# EAGLE design PVDF_pre_amp (EAGLE 7.5.0)
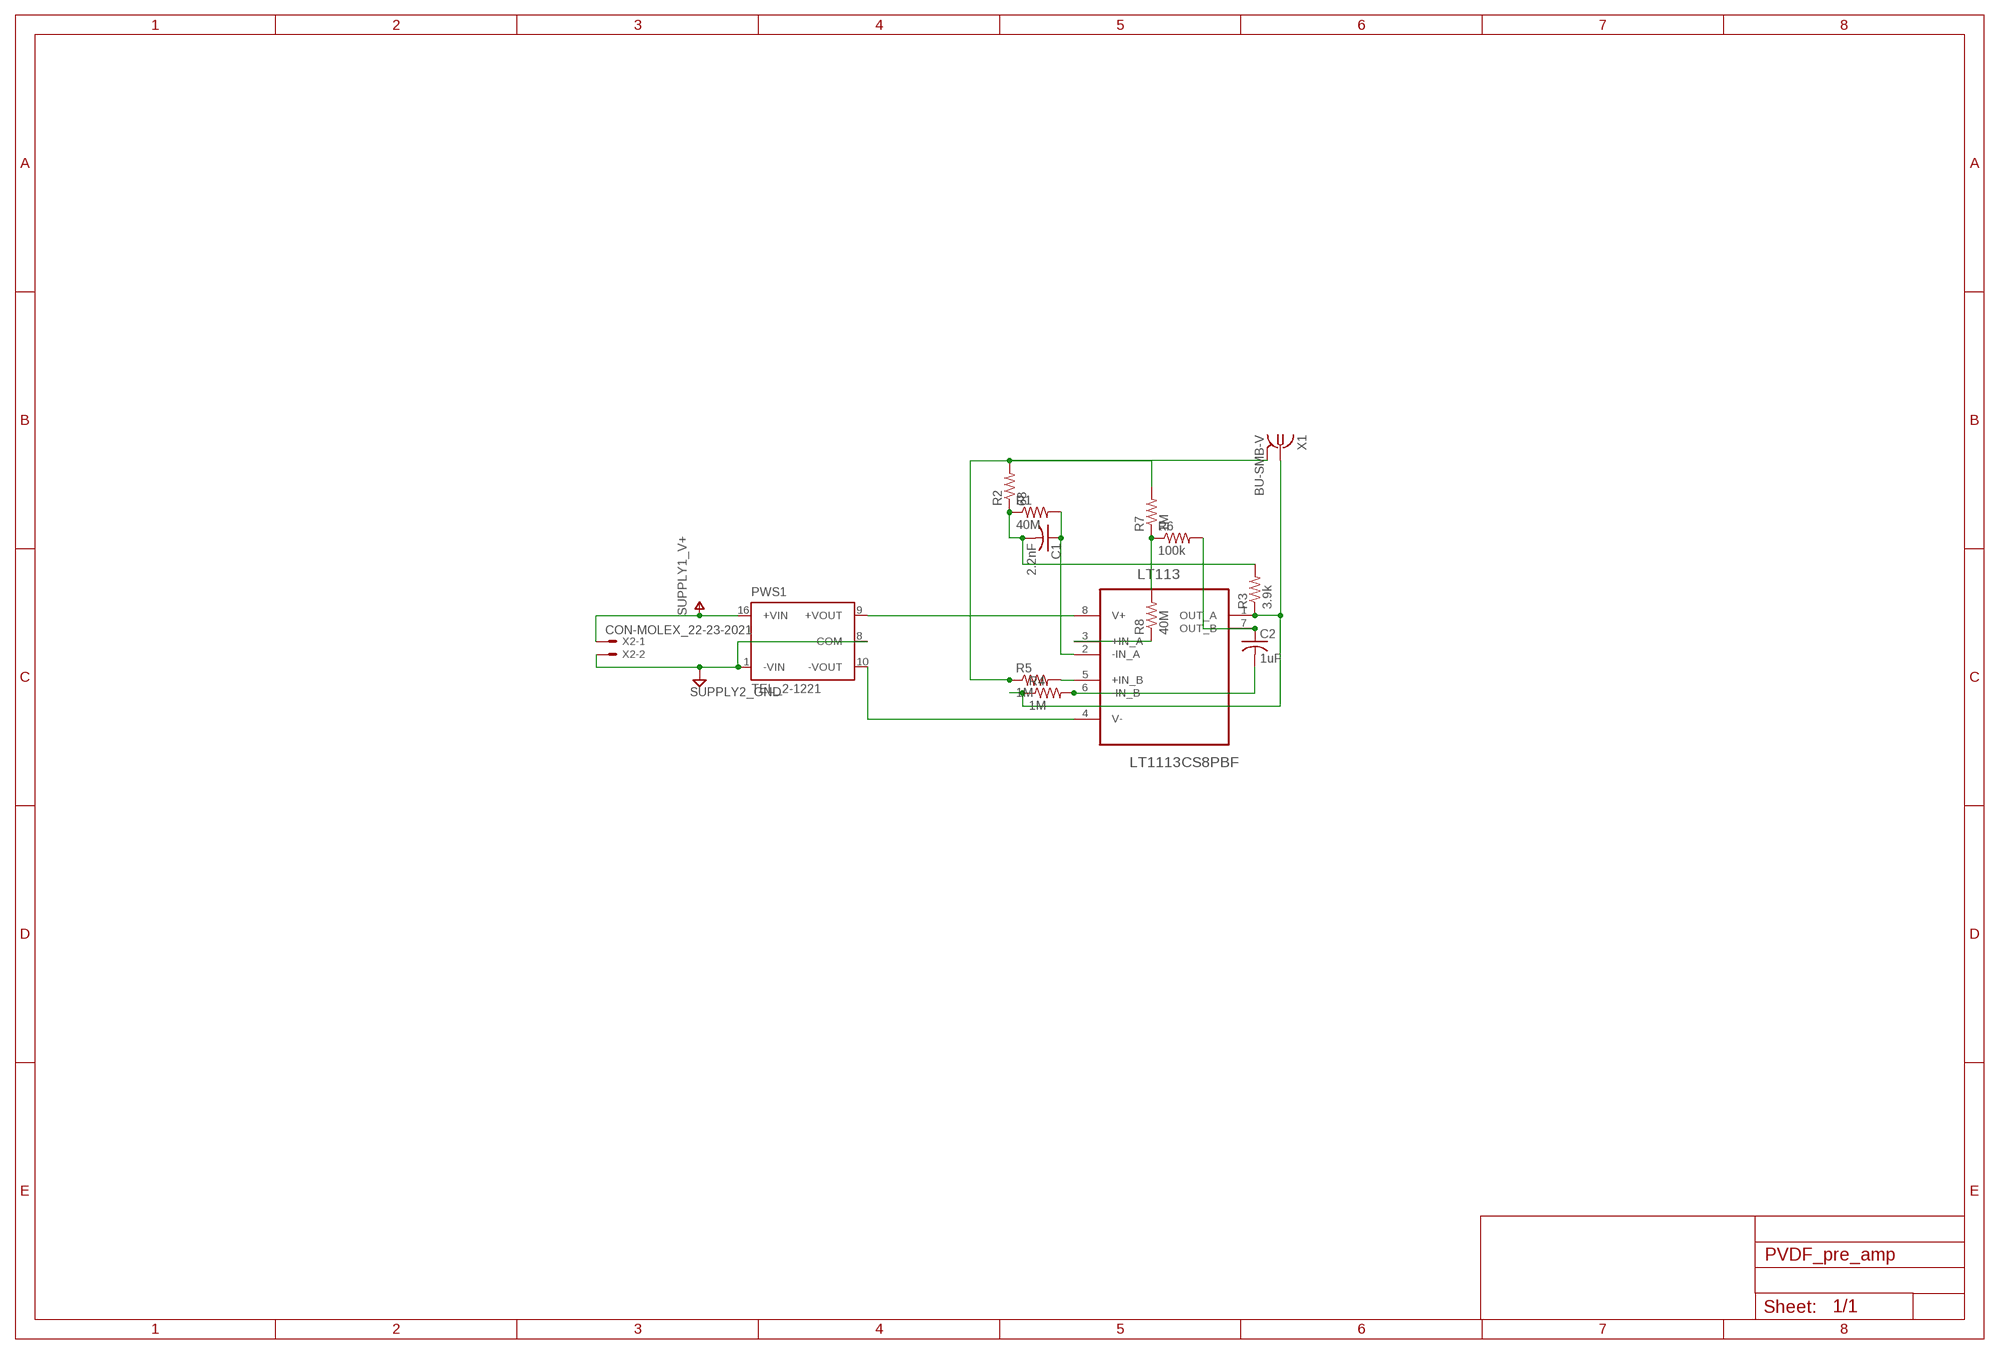
[diagram p0: schematic, sheet 1]

## Parts
C1  2.2nF  ADAFRUIT_C-USC0805K  [ADAFRUIT_C0805K]
C2  1uF  ADAFRUIT_C-USC0805K  [ADAFRUIT_C0805K]
LT113  LT1113CS8PBF  [SOIC127P600X175-8N]
PWS1  TEL_2-1221  [TRACOPOWER2W]
R1  40M  ADAFRUIT_R-US_R0805  [ADAFRUIT_R0805]
R2  68  ADAFRUIT_R-US_R0805  [ADAFRUIT_R0805]
R3  3.9k  ADAFRUIT_R-US_R0805  [ADAFRUIT_R0805]
R4  1M  ADAFRUIT_R-US_R0805  [ADAFRUIT_R0805]
R5  1M  ADAFRUIT_R-US_R0805  [ADAFRUIT_R0805]
R6  100k  ADAFRUIT_R-US_R0805  [ADAFRUIT_R0805]
R7  1M  ADAFRUIT_R-US_R0805  [ADAFRUIT_R0805]
R8  40M  ADAFRUIT_R-US_R0805  [ADAFRUIT_R0805]
X1  BU-SMB-V  [BU-SMB-V]
X2  CON-MOLEX_22-23-2021  [CON-MOLEX_22-23-2021]

## Nets
1+IN_B: LT113.5(+IN_B) R5.2
1-IN_A: C1.1 LT113.2(-IN_A) R1.2
1-IN_B: C2.2 LT113.6(-IN_B) R4.2
1OUT_B: C2.1 LT113.7(OUT_B) R6.2
1W1: C1.2 R1.1 R2.1 R3.2
1W2: R6.1 R7.1 R8.2
+AVDD: LT113.8(V+) PWS1.9(+VOUT)
-AVDD: LT113.4(V-) PWS1.10(-VOUT)
ADC1_NEG: LT113.1(OUT_A) R3.1 R4.1 X1.1
GND: PWS1.1(-VIN) PWS1.8(COM) R2.2 R5.1 R7.2 X1.2 X1.3 X1.4 X1.5 X2.2 ; supply symbol labelled SUPPLY2_GND
INPUT1_NEG: LT113.3(+IN_A) R8.1
V+: PWS1.16(+VIN) X2.1 ; supply symbol labelled SUPPLY1_V+

## Library data of the parts
C1 C2 = BBB_ADS1271_front_panel:ADAFRUIT_C-US: CAPACITOR, American symbol
LT113 = BBB_ADS1271_front_panel:LT1113CS8PBF: Dual Low Noise,Precision, JFET Input Op Amp; MPN: LT1113CS8#PBF; OC_FARNELL: 1503417; OC_NEWARK: 57M1747; PACKAGE: SOIC-8; SUPPLIER: Linear Technology
PWS1 = BBB_ADS1271_cape:TEL_2-: DC/DC-Konverter 2 Watt, 1 x Input, 1 x +- Output Source: http://www.tracopower.com/datasheet_g/tel2-d.pdf; MPN: TEL 2-1221; OC_FARNELL: 1007032; OC_NEWARK: 51R4760
R1-R8 = BBB_ADS1271_front_panel:ADAFRUIT_R-US_: RESISTOR, American symbol
X1 = BBB_ADS1271_front_panel:BU-SMB-V: FEMALE SMB CONNECTOR Radiall distributor RS 112-2993; OC_FARNELL: unknown; OC_NEWARK: unknown
X2 = BBB_ADS1271_front_panel:CON-MOLEX_22-23-2021: .100" (2.54mm) Center Header - 2 Pin; MF: MOLEX; MPN: 22-23-2021; OC_FARNELL: 1462926; OC_NEWARK: 25C3832

## Board
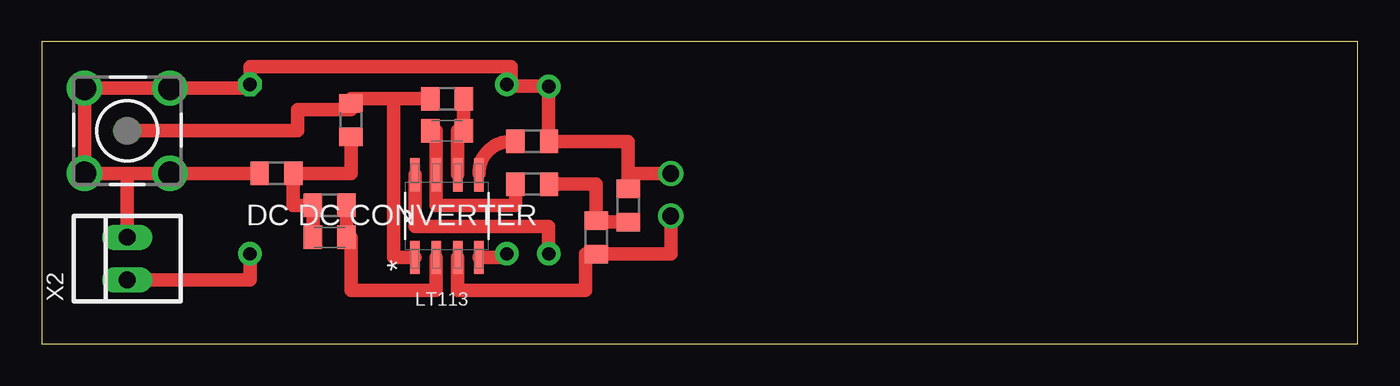
[diagram p1: board, top side]
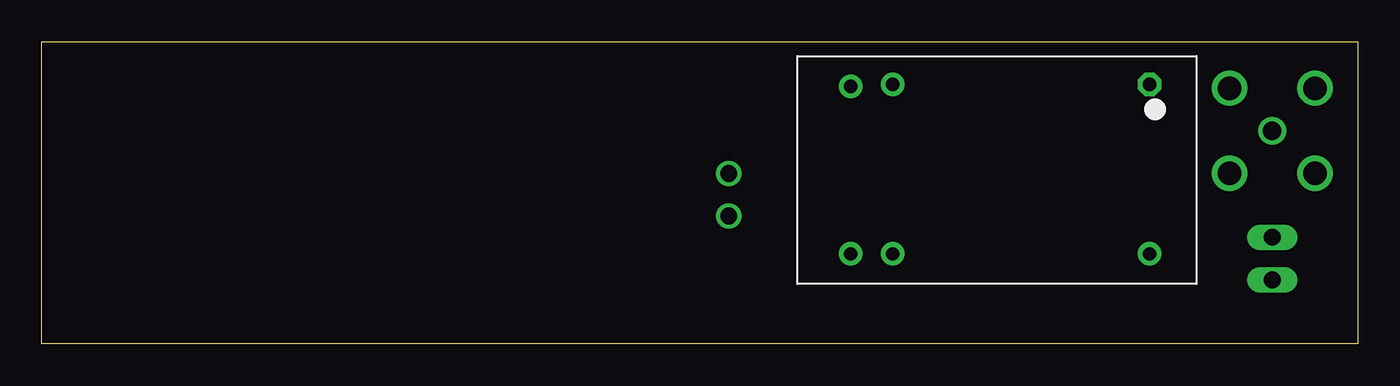
[diagram p2: board, bottom side, seen from below]

Size 78.38 x 18 mm. Coordinates in mm from the lower left corner, seen from the top.
Outline: 0,0 78.38,0 78.38,18 0,18 0,0
Copper layers (1*16): Top 0.035mm / dielectric 1.5mm / Bottom 0.035mm
Design rules "pcb_design_rules": minimum track width 10mil, minimum drill 24mil, track to track 20mil, track to pad 20mil, pad to pad 8mil, via to via 20mil, smd to smd 8mil, copper to edge 40mil, drill to drill 8mil, minimum pad ring 10mil, minimum via ring 8mil, stop-mask expansion 4mil, vias tented up to drill 0mil, thermal gap 10mil

### Footprints (pad centres in the part's own frame; a part is rotated, then mirrored left to right if it is on the bottom)
ADAFRUIT_C0805K = smd 1.1 x 1.4: 1 -1,0; 2 1,0
SOIC127P600X175-8N = smd 1.981 x 0.559: 1 -2.464,1.905; 2 -2.464,0.635; 3 -2.464,-0.635; 4 -2.464,-1.905; 5 2.464,-1.905; 6 2.464,-0.635; 7 2.464,0.635; 8 2.464,1.905
TRACOPOWER2W = drill 0.8 pad 1.4 octagon: 1 -9.2,-5.3 | drill 0.8 pad 1.4: 7 6.1,-5.3; 8 8.6,-5.2; 9 8.6,4.8; 10 6.1,4.8; 16 -9.2,4.8
ADAFRUIT_R0805 = smd 1.1 x 1.4: 1 -1,0; 2 1,0
BU-SMB-V = drill 1.1: 1 0,0 | drill 1.4: 2 -2.54,2.54; 3 2.54,2.54; 4 2.54,-2.54; 5 -2.54,-2.54
CON-MOLEX_22-23-2021 = drill 1 long: 1 -1.27,0; 2 1.27,0

### Placement (x,y rotation side)
C1  17.14,6.35 180 top
C2  24.13,12.7 0 top
LT113  24.13,7.62 90 top
PWS1  21.59,10.16 180 bottom
R1  17.14,8.26 0 top
R2  13.97,10.16 180 top
R3  18.41,13.34 270 top
R4  24.13,14.61 0 top
R5  29.21,12.06 180 top
R6  29.21,9.53 180 top
R7  34.92,8.26 90 top
R8  33.02,6.35 90 top
X1  5.08,12.7 0 top
X2  5.08,5.08 90 top

### Tracks (layer width: path | path; a pad name or v marks a point on that pad's centre or on a via)
1+IN_B
  Top 0.406: LT113.5 26.04,10.16
  Top 0.813: 26.04,10.16 arc-90 27.94,12.06 R5.2
1-IN_A
  Top 0.813: R1.2 C1.1 18.41,6.35 18.41,3.17 23.5,3.17 LT113.2
1-IN_B
  Top 0.406: 24.77,12.7 C2.2
  Top 0.813: LT113.6 24.77,12.7 | C2.2 R4.2
1OUT_B
  Top 0.406: C2.1 23.5,12.7
  Top 0.813: 23.5,12.7 LT113.7 23.5,8.26 28.21,8.26 R6.2
1W1
  Top 0.813: C1.2 R1.1 14.97,8.26 R2.1 18.41,10.16 R3.2
1W2
  Top 0.813: R7.1 33.02,7.25 R8.2 33.02,9.53 R6.1
+AVDD
  Top 0.813: PWS1.9 30.19,6.99 22.23,6.99 LT113.8
-AVDD
  Top 0.813: LT113.4 27.69,5.16 PWS1.10
ADC1_NEG
  Top 0.813: LT113.1 20.95,5.16 20.95,14.61 | 20.95,14.61 R4.1 | X1.1 15.24,12.7 15.24,13.97 18.41,13.97 R3.1 18.41,14.61 20.95,14.61
GND  (via drill 1)
  Top 0.813: X2.2 5.08,10.16 | 5.08,10.16 X1.4 R2.2 | 5.08,10.16 X1.5 X1.2 X1.3 12.39,15.24 PWS1.1 12.39,16.51 27.94,16.51 27.94,15.36 PWS1.8 30.19,12.06 R5.1 34.92,12.06 R7.2 34.92,10.16 v37.47,10.16
INPUT1_NEG  (via drill 1)
  Top 0.813: v37.47,7.62 37.47,5.35 R8.1 32.38,5.35 32.38,3.17 24.77,3.17 LT113.3
V+
  Top 0.813: PWS1.16 12.39,3.81 X2.1